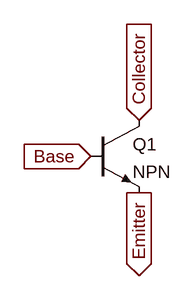
[diagram p0: schematic Transistor_Switch_(powerAMP_for_Teensy_to_relay).asc]
Transistor_Switch_(powerAMP_for_Teensy_to_relay).asc, the LTspice schematic file:
Version 4
SHEET 1 880 680
FLAG 128 144 Base
IOPIN 128 144 In
FLAG 192 192 Emitter
IOPIN 192 192 Out
FLAG 192 96 Collector
IOPIN 192 96 In
SYMBOL npn 128 96 R0
SYMATTR InstName Q1

The netlist it stands for:
* Transistor_Switch_(powerAMP_for_Teensy_to_relay).asc
Q1 Collector Base Emitter 0 NPN
.model NPN NPN
.model PNP PNP
.lib standard.bjt
.backanno
.end